# EAGLE design Moirai (EAGLE 9.6.2)
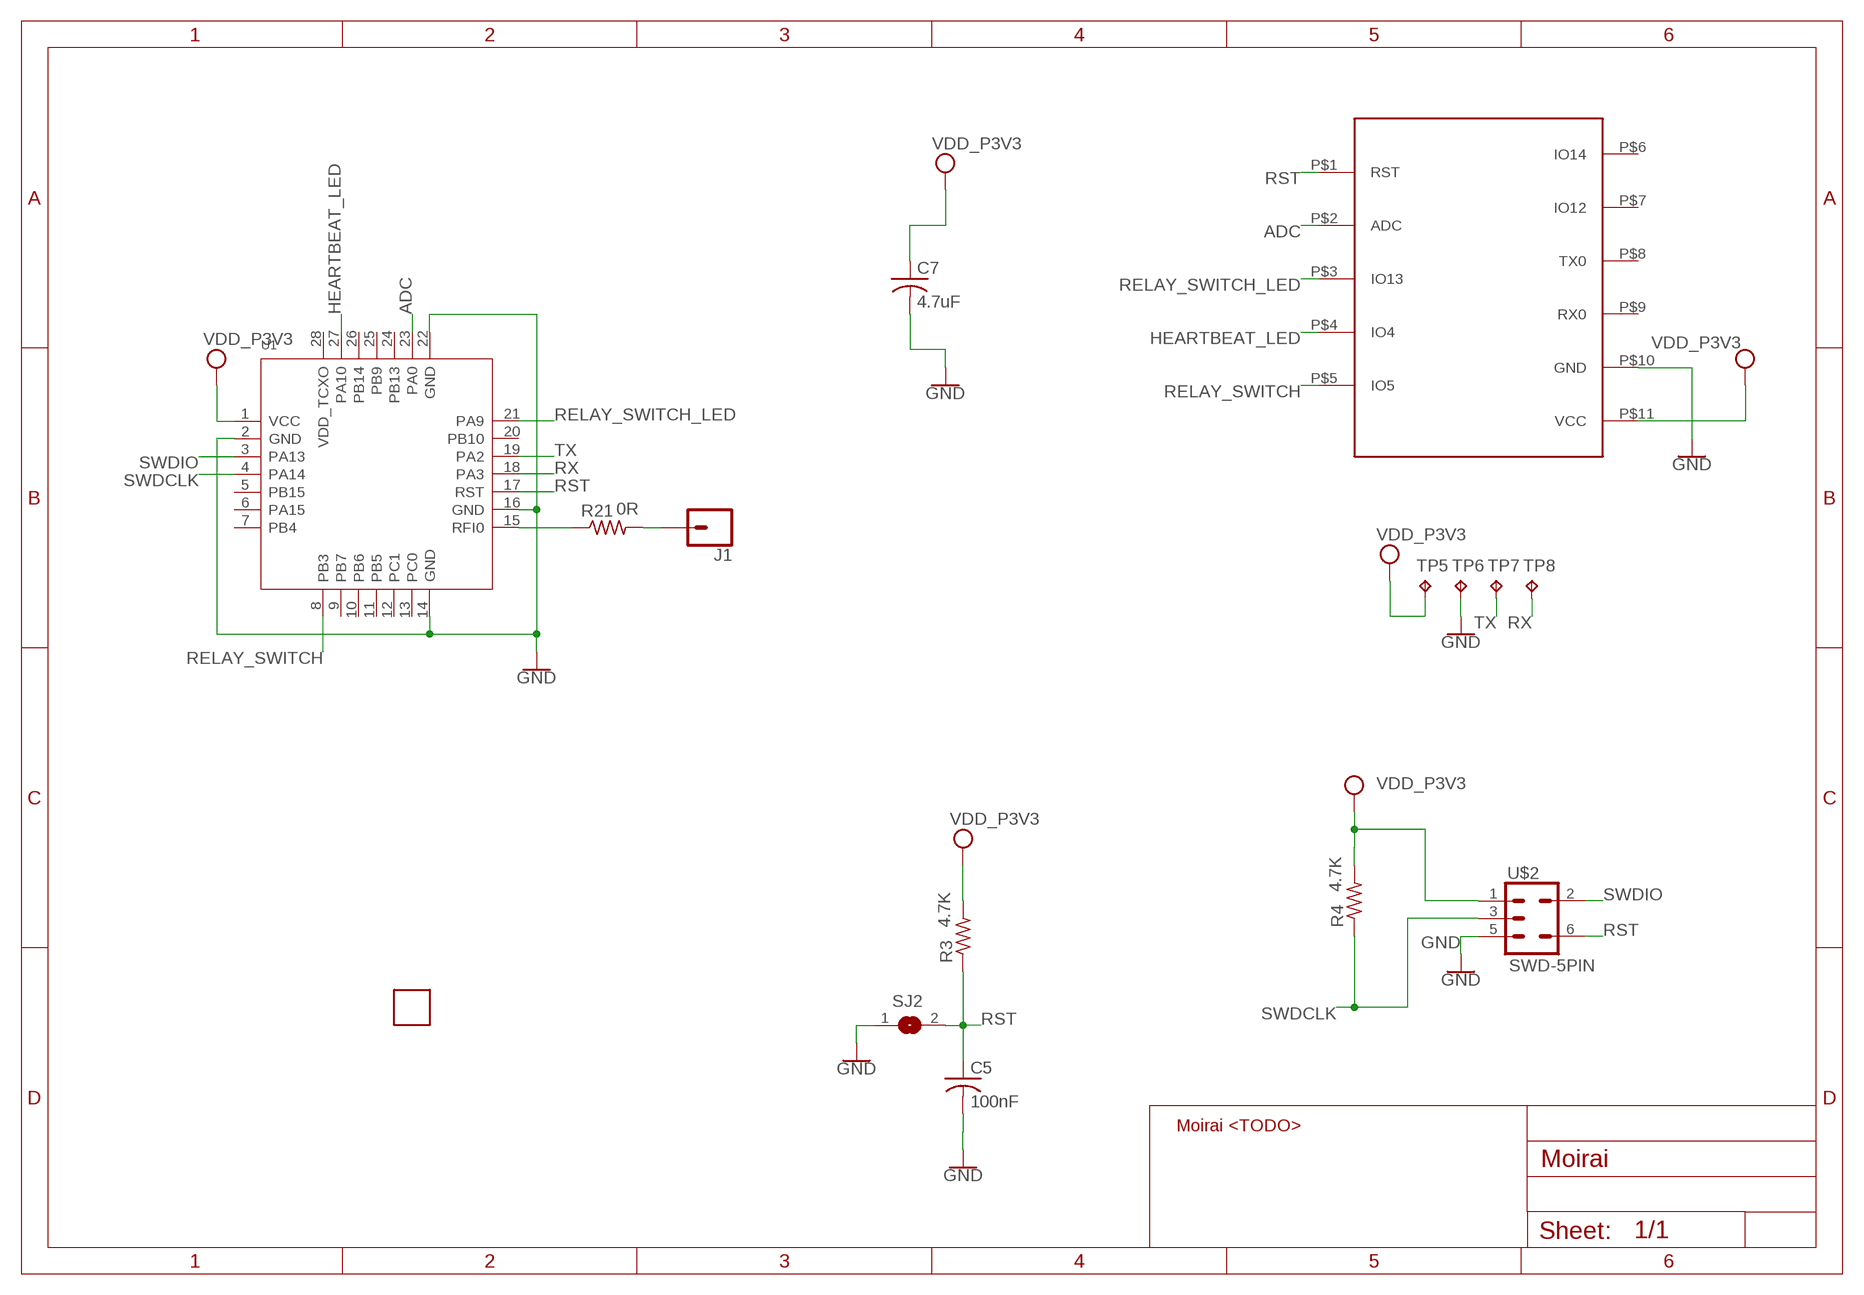
[diagram p0: schematic, sheet 1]

## Parts
C5  100nF  C-USC0402  [C0402]
C7  4.7uF  C-USC0402  [C0402]
J1  CONN_01  [1X01]
R3  4.7K  R-US_R0402  [R0402]
R4  4.7K  R-US_R0402  [R0402]
R21  0R  R-US_R0402  [R0402]
SJ2  SJ  [SJ]
TP5  TPB1,27  [B1,27]
TP6  TPB1,27  [B1,27]
TP7  TPB1,27  [B1,27]
TP8  TPB1,27  [B1,27]
U1  MODULE_LORA_E5  [MODULE28P-1.25-12X12X2.5MM]
U$1  ESP02SESP02S_MIRROR  [ESP02S_MIRROR]
U$2  SWD-5PIN  [PAD_05_03X2_TP_NO4]
U$3  SMARTT_SMALL  [SMARTT_SMALL]

## Nets
ADC: U1.23(PA0) U$1.P$2(ADC)
GND: C5.2 C7.2 SJ2.1 TP6.TP U1.2(GND) U1.14(GND) U1.16(GND) U1.22(GND) U$1.P$10(GND) U$2.5
HEARTBEAT_LED: U1.27(PA10) U$1.P$4(IO4)
N$5: R21.1 U1.15(RFI0)
N$6: J1.1 R21.2
RELAY_SWITCH: U1.8(PB3) U$1.P$5(IO5)
RELAY_SWITCH_LED: U1.21(PA9) U$1.P$3(IO13)
RST: C5.1 R3.1 SJ2.2 U1.17(RST) U$1.P$1(RST) U$2.6
RX: TP8.TP U1.18(PA3)
SWDCLK: R4.1 U1.4(PA14) U$2.3
SWDIO: U1.3(PA13) U$2.2
TX: TP7.TP U1.19(PA2)
VCC: C7.1 R3.2 R4.2 TP5.TP U1.1(VCC) U$1.P$11(VCC) U$2.1 ; supply symbol labelled VDD_P3V3
Unconnected: U1.5(PB15) U1.6(PA15) U1.7(PB4) U1.9(PB7) U1.10(PB6) U1.11(PB5) U1.12(PC1) U1.13(PC0) U1.20(PB10) U1.24(PB13) U1.25(PB9) U1.26(PB14) U1.28(VDD_TCXO) U$1.P$6(IO14) U$1.P$7(IO12) U$1.P$8(TX0) U$1.P$9(RX0)

## Notes on the sheet
- Moirai <TODO>

## Library data of the parts
C5 C7 = adafruit:C-US: CAPACITOR, American symbol
J1 = SparkFun-Connectors:CONN_01: Single connection point. Often used as Generic Header-pin footprint for 0.1 inch spaced/style header connections On any of the 0.1 inch spaced packages, you can populate with these: Break Away Headers - Straight <https://www.sparkfun.com/products/116> (PRT-00116) Break Away Male Headers - Right Angle <https://www.sparkfun.com/products/553> (PRT-00553) Female Headers <https://www.sparkfun.com/products/115> (PRT-00115) Break Away Headers - Machine Pin <https://www.sparkfun.com/products/117> (PRT-00117) Break Away Female Headers - Swiss Machine Pin <https://www.sparkfun.com/products/743> (PRT-00743) This device is also useful as a general connection point to wire up your design to another part of your project. Our various solder wires solder well into these plated through hole pads. Hook-Up Wire - Assortment (Stranded, 22 AWG) <https://www.sparkfun.com/products/11375> (PRT-11375) Hook-Up Wire - Assortment (Solid Core, 22 AWG) <https://www.sparkfun.com/products/11367> (PRT-11367) View the entire wire category on our website here <https://www.sparkfun.com/categories/141> Special notes: SMTSO-256-ET is a "flush mount" nut for a 4-40 screw. We mostly use this on specialty testbeds; it is a nice way to connect hardware to your PCB at an adjustable hieght. Also note, the SNAP packages are for using a snappable style connector. We sell a baggie of snaps and they are also used on two LilyPad designs: Snap Assortment - 30 pack (male and female) <https://www.sparkfun.com/products/11347> (DEV-11347) LilyPad Arduino SimpleSnap <https://www.sparkfun.com/products/10941> (DEV-10941) LilyPad SimpleSnap Protoboard <https://www.sparkfun.com/products/10940> (DEV-10940)
R3 R4 R21 = adafruit:R-US_: RESISTOR, American symbol
SJ2 = jumper:SJ: SMD solder JUMPER
TP5-TP8 = testpad:TP: Test pad
U1 = LORA-E5_Eagle_Library:MODULE_LORA_E5
U$1 = ESP02s:ESP02S
U$2 = SparkFun-Connectors:SWD-5PIN: 5-pin SWD connector Test-point based header for SWD. Pin 1 - PWR Pin 2 - SWDIO Pin 3 - SWCLK Pin 4 - NC Pin 5 - GND Pin 6 - RESET
U$3 = Bitmaps:SMARTT_SMALL

## Board
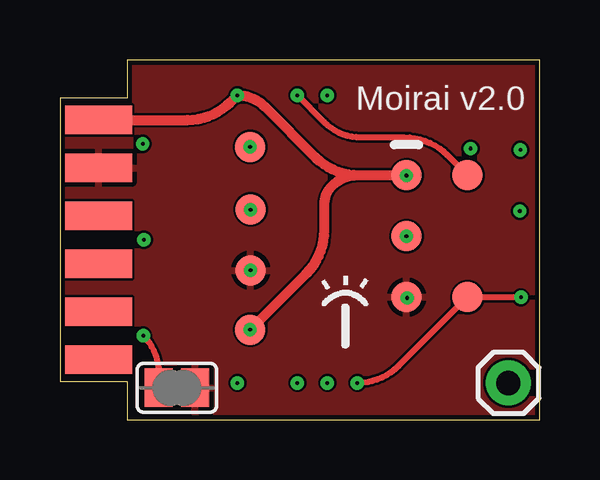
[diagram p1: board, top side]
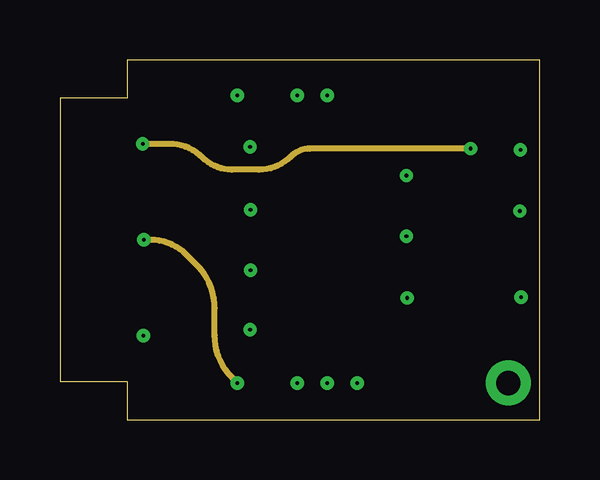
[diagram p2: board, inner layer Route2]
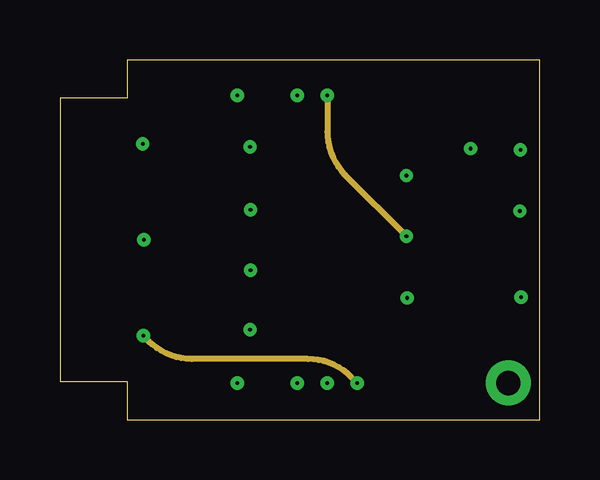
[diagram p3: board, inner layer Route3]
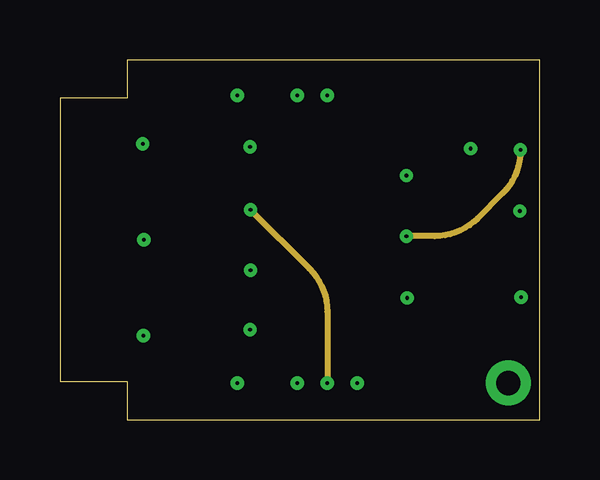
[diagram p4: board, inner layer Route14]
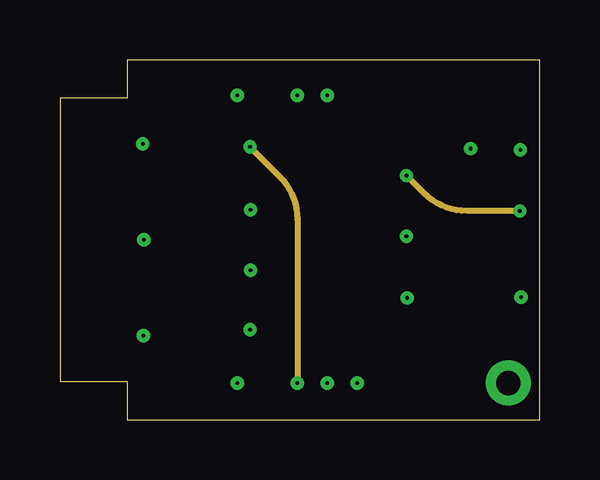
[diagram p5: board, inner layer Route15]
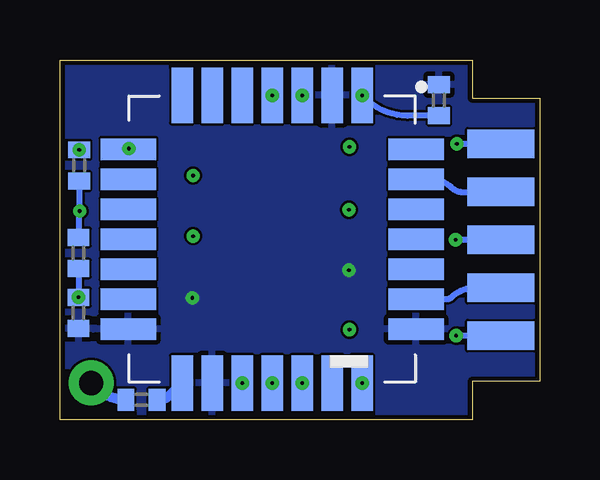
[diagram p6: board, bottom side, seen from below]

Size 20 x 15 mm. Coordinates in mm from the lower left corner, seen from the top.
Outline: 20,15 2.8,15 2.8,13.4 0,13.4 0,1.6 2.8,1.6 2.8,0 20,0 20,15
Copper layers ((1+2)*3+14*15+16): Top 0.035mm / dielectric 0.1mm / Route2 0.035mm / dielectric 0.1mm / Route3 0.035mm / dielectric 0.14mm / Route14 0.035mm / dielectric 0.15mm / Route15 0.035mm / dielectric 0.1mm / Bottom 0.035mm
Design rules "Nordic *": minimum track width 0.1mm, minimum drill 0.15mm, track to track 0.1mm, track to pad 0.1mm, pad to pad 0.1mm, via to via 0.1mm, smd to smd 0.1mm, copper to edge 0.2mm, drill to drill 0.2mm, minimum pad ring 10mil, minimum via ring 8mil, stop-mask expansion 4mil, vias tented up to drill 0mil, thermal gap 0.2mm

### Footprints (pad centres in the part's own frame; a part is rotated, then mirrored left to right if it is on the bottom)
C0402 = smd 0.7 x 0.9: 1 -0.65,0; 2 0.65,0
1X01 = drill 1.016 pad 1.88: 1 0,0
R0402 = smd 0.7 x 0.9: 1 -0.65,0; 2 0.65,0
SJ = smd 1.168 x 1.6: 1 -0.762,0; 2 0.762,0
B1,27 = smd 1.27 x 1.27: TP 0,0
MODULE28P-1.25-12X12X2.5MM = smd 2.3 x 0.9: 1 -6,3.75; 2 -6,2.5; 3 -6,1.25; 4 -6,0; 5 -6,-1.25; 6 -6,-2.5; 7 -6,-3.75; 15 6,-3.75; 16 6,-2.5; 17 6,-1.25; 18 6,0; 19 6,1.25; 20 6,2.5; 21 6,3.75 | smd 0.9 x 2.3: 8 -3.75,-6; 9 -2.5,-6; 10 -1.25,-6; 11 0,-6; 12 1.25,-6; 13 2.5,-6; 14 3.75,-6; 22 3.75,6; 23 2.5,6; 24 1.25,6; 25 0,6; 26 -1.25,6; 27 -2.5,6; 28 -3.75,6
ESP02S_MIRROR = smd 1.2 x 2.8 bottom: P$1 -3.81,0; P$2 -1.81,0; P$3 0.19,0; P$4 2.19,0; P$5 4.19,0 | smd 1.2 x 2.8: P$6 -4.81,0; P$7 -2.81,0; P$8 -0.81,0; P$9 1.19,0; P$10 3.19,0; P$11 5.19,0
PAD_05_03X2_TP_NO4 = smd 1.27 x 1.27: 1 -2.54,-1.27; 2 -2.54,1.27; 3 0,-1.27; 5 2.54,-1.27; 6 2.54,1.27

### Placement (x,y rotation side)
C5  19.23,4.45 270 bottom
C7  4.2,13.32 90 bottom
J1  18.7,1.52 270 top
R3  19.23,6.95 90 bottom
R4  19.2,10.6 270 bottom
R21  16.6,0.82 180 bottom
SJ2  4.88,1.32 180 top
TP5  7.93,3.75 90 top
TP6  7.96,6.22 90 top
TP7  7.93,11.37 90 top
TP8  7.96,8.77 90 top
U1  11.15,7.53 270 bottom
U$1  1.61,7.31 90 top
U$2  15.72,7.65 270 top
U$3  13.18,2.85 0 bottom

### Tracks (layer width: path | path; a pad name or v marks a point on that pad's centre or on a via)
ADC
  Bottom 0.254: U1.23 3.86,5.03 arc-45 3.67,5.1 arc45 2.71,5.5 U$1.P$2
GND  (via drill 0.15)
  Top 0.254: U$2.5 14.46,5.09 v14.47,5.08 | TP6.TP v7.95,6.22
  pour Top: 20,0 2.8,0 2.8,1.6 0,1.6 0,13.41 2.79,13.41 2.8,13.4 2.8,15 20,15
  pour Bottom: 20,0 2.8,0 2.8,1.6 0,1.6 0,13.4 2.8,13.4 2.8,15 20,15
HEARTBEAT_LED
  Bottom 0.254: U1.27 4.57,10.03 arc45 3.6,9.62 arc-45 3.3,9.5 U$1.P$4
N$5
  Bottom 0.406: U1.15 15.35,1.07 arc45 R21.1
N$6
  Bottom 0.406: R21.2 arc45 18.53,1.35 J1.1
RELAY_SWITCH  (via drill 0.15)
  Route2 0.254: v17.12,11.3 10.41,11.3 arc45 9.62,10.97 arc-45 8.3,10.43 7.16,10.43 arc-45 5.95,10.93 arc45 4.56,11.5 v3.45,11.5
  Bottom 0.152: U1.8 v17.12,11.3
  Bottom 0.254: U$1.P$5 v3.45,11.5
RELAY_SWITCH_LED  (via drill 0.15)
  Route2 0.254: v7.4,1.52 7.19,1.73 arc-45 6.45,3.53 6.45,4.65 arc45 5.71,6.44 5.28,6.88 arc45 3.77,7.5 v3.5,7.5
  Bottom 0.254: U$1.P$3 v3.5,7.5
RST  (via drill 0.15)
  Top 0.254: v3.48,3.5 arc-45 4.11,1.96 SJ2.2 | v12.4,1.52 arc45 14.12,2.24 U$2.6 19.2,5.11 arc-45 C5.1
  Route3 0.254: v12.4,1.52 12.14,1.78 arc45 10.35,2.52 5.5,2.52 arc-45 3.71,3.27 v3.48,3.5
  Bottom 0.254: U$1.P$1 v3.48,3.5 | R3.1 C5.1
  other vias: 19.23,5.1
RX  (via drill 0.15)
  Top 0.254: TP8.TP TP8.TP arc45 v7.95,8.75
  Route14 0.254: v7.95,8.75 10.41,6.29 arc-45 11.15,4.5 v11.15,1.52
SWDCLK  (via drill 0.15)
  Top 0.152: U$2.3 v14.45,7.65
  Route3 0.254: U1.4 11.15,12 arc45 11.89,10.21 v14.45,7.65
  Route14 0.254: R4.1 19.2,11.23 arc-45 18.46,9.43 17.42,8.39 arc-45 15.62,7.65 v14.45,7.65
  other vias: 11.15,13.53 19.2,11.25
SWDIO  (via drill 0.15)
  Top 0.254: U1.3 11.01,12.41 arc45 12.55,11.78 14.36,11.78 arc-45 16.15,11.03 U$2.2
  other vias: 9.9,13.53
TX  (via drill 0.15)
  Top 0.254: TP7.TP arc-45 v7.92,11.38
  Route15 0.254: v7.92,11.38 9.16,10.14 arc-45 9.9,8.35 v9.9,1.52
VCC  (via drill 0.15)
  Top 0.254: TP5.TP v7.92,3.75 | U$2.1 U$2.1 arc-45 v14.45,10.18
  Top 0.406: U$1.P$11 5.32,12.5 arc45 7.12,13.24 U1.1 arc-45 8.55,13.05 10.67,10.93 arc45 12.46,10.19 | 12.46,10.19 U$2.1 | TP5.TP 10.28,6.1 arc45 11.03,7.89 11.03,8.96 arc-45 11.35,9.75 arc-45 12.41,10.19 12.46,10.19
  Route15 0.254: v19.18,8.7 16.98,8.7 arc-45 15.18,9.44 v14.45,10.18
  Bottom 0.254: C7.1 5.5,12.68 arc45 7.29,13.42 U1.1 | R4.2 19.2,8.72 v19.18,8.7 arc-45 19.23,8.58 R3.2
  other vias: 7.4,13.53

### Text on the board
tNames: Moirai v2.0